# EAGLE schematic 20180513_Frontboard (EAGLE 9.0.1)
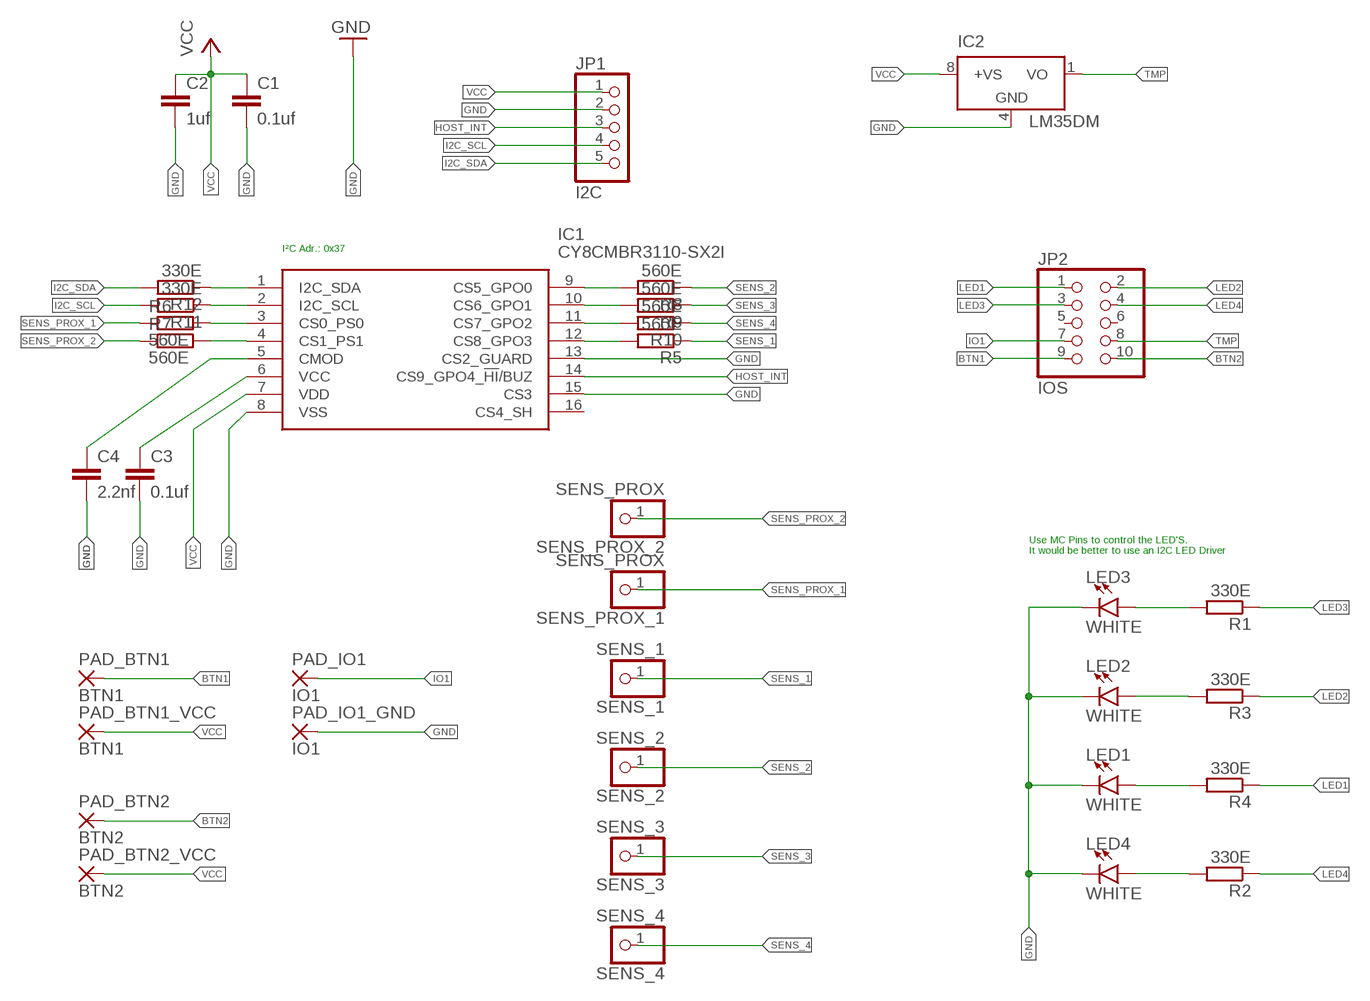
[diagram p0: schematic, sheet 1]

## Parts
C1  0.1uf  C-EUC0805  [C0805]
C2  1uf  C-EUC0805  [C0805]
C3  0.1uf  C-EUC0805  [C0805]
C4  2.2nf  C-EUC0805  [C0805]
IC1  CY8CMBR3110-SX2I  [SOIC127P600X173-16N]
IC2  LM35DM  [SO08]
JP1  I2C  PINHD-1X5_2.54-SMD  [1X05SMD]
JP2  IOS  PINHD-2X5_2.54-SMD  [2X05SMD]
LED1  WHITE  LED1206-BOTTOM  [LED-1206-BOTTOM]
LED2  WHITE  LED1206-BOTTOM  [LED-1206-BOTTOM]
LED3  WHITE  LED1206-BOTTOM  [LED-1206-BOTTOM]
LED4  WHITE  LED1206-BOTTOM  [LED-1206-BOTTOM]
PAD_BTN1  BTN1  2,54/1,0  [2,54/1,0]
PAD_BTN1_VCC  BTN1  2,54/1,0  [2,54/1,0]
PAD_BTN2  BTN2  2,54/1,0  [2,54/1,0]
PAD_BTN2_VCC  BTN2  2,54/1,0  [2,54/1,0]
PAD_IO1  IO1  2,54/1,0  [2,54/1,0]
PAD_IO1_GND  IO1  2,54/1,0  [2,54/1,0]
R1  330E  R-EU_R0805  [R0805]
R2  330E  R-EU_R0805  [R0805]
R3  330E  R-EU_R0805  [R0805]
R4  330E  R-EU_R0805  [R0805]
R5  560E  R-EU_R0805  [R0805]
R6  560E  R-EU_R0805  [R0805]
R7  560E  R-EU_R0805  [R0805]
R8  560E  R-EU_R0805  [R0805]
R9  560E  R-EU_R0805  [R0805]
R10  560E  R-EU_R0805  [R0805]
R11  330E  R-EU_R0805  [R0805]
R12  330E  R-EU_R0805  [R0805]
SENS_1  SENS_1  WPAD-1-0603  [WPAD-1-0603]
SENS_2  SENS_2  WPAD-1-0603  [WPAD-1-0603]
SENS_3  SENS_3  WPAD-1-0603  [WPAD-1-0603]
SENS_4  SENS_4  WPAD-1-0603  [WPAD-1-0603]
SENS_PROX_1  SENS_PROX  WPAD-1-0603  [WPAD-1-0603]
SENS_PROX_2  SENS_PROX  WPAD-1-0603  [WPAD-1-0603]

## Nets
BTN1: JP2.9 PAD_BTN1.1(P)
BTN2: JP2.10 PAD_BTN2.1(P)
GND: C1.2 C2.2 C3.2 C4.2 IC1.8(VSS) IC1.13(CS2_GUARD) IC1.15(CS3) IC2.4(GND) JP1.2 LED1.C LED2.C LED3.C LED4.C PAD_IO1_GND.1(P)
HOST_INT: IC1.14(CS9_GPO4_!HI!/BUZ) JP1.3
I2C_SCL: JP1.4 R11.2
I2C_SDA: JP1.5 R12.2
IO1: JP2.7 PAD_IO1.1(P)
LED1: JP2.1 R4.1
LED2: JP2.2 R3.1
LED3: JP2.3 R1.1
LED4: JP2.4 R2.1
N$2: IC1.9(CS5_GPO0) R8.2
N$3: IC1.10(CS6_GPO1) R9.2
N$4: IC1.11(CS7_GPO2) R10.2
N$5: IC1.1(I2C_SDA) R12.1
N$6: IC1.2(I2C_SCL) R11.1
N$7: IC1.3(CS0_PS0) R6.2
N$8: IC1.12(CS8_GPO3) R5.2
N$9: C3.1 IC1.6(VCC)
N$10: C4.1 IC1.5(CMOD)
N$11: IC1.4(CS1_PS1) R7.2
N$14: LED4.A R2.2
N$15: LED1.A R4.2
N$16: LED2.A R3.2
N$17: LED3.A R1.2
SENS_1: R5.1 SENS_1.1
SENS_2: R8.1 SENS_2.1
SENS_3: R9.1 SENS_3.1
SENS_4: R10.1 SENS_4.1
SENS_PROX_1: R6.1 SENS_PROX_1.1
SENS_PROX_2: R7.1 SENS_PROX_2.1
TMP: IC2.1(VO) JP2.8
VCC: C1.1 C2.1 IC1.7(VDD) IC2.8(+VS) JP1.1 PAD_BTN1_VCC.1(P) PAD_BTN2_VCC.1(P)
Unconnected: IC1.16(CS4_SH) JP2.5 JP2.6

## Notes on the sheet
- I²C Adr.: 0x37
- Use MC Pins to control the LED'S. 
  It would be better to use an I2C LED Driver

## Library data of the parts
C1-C4 = rcl:C-EU: CAPACITOR, European symbol; SPICEPREFIX: C
IC1 = CY8CMBR3110-SX2I:CY8CMBR3110-SX2I: CY8CMBR3xxx Source: Datasheet <http://www.cypress.com/file/46236/download>; ARROW_PART_NUMBER: CY8CMBR3110-SX2I; ARROW_PRICE/STOCK: https://www.arrow.com/en/products/cy8cmbr3110-sx2i/cypress-semiconductor; DESCRIPTION: CY8CMBR3xxx; HEIGHT: mm; MANUFACTURER_NAME: Cypress Semiconductor; MANUFACTURER_PART_NUMBER: CY8CMBR3110-SX2I; RS_PART_NUMBER: 1242975P; RS_PRICE/STOCK: http://uk.rs-online.com/web/p/products/1242975P
IC2 = lm35 (2):LM35: Single-Supply Centigrade Temperature Sensor Vout = (10mV/°C x Temp °C) +5mmmV Source: http://www.national.com/ds/LM/LM35.pdf
JP1 = pinhead:PINHD-1X5: PIN HEADER
JP2 = pinhead:PINHD-2X5: PIN HEADER
LED1-LED4 = SparkFun-LED:LED: LED (Generic) Standard schematic elements and footprints for 5mm, 3mm, 1206, and 0603 sized LEDs. Generic LEDs with no color specified.
PAD_BTN1 PAD_BTN1_VCC PAD_BTN2 PAD_BTN2_VCC PAD_IO1 PAD_IO1_GND = wirepad:2,54/1,0: THROUGH-HOLE PAD
R1-R12 = resistor:R-EU_: RESISTOR, European symbol
SENS_1-SENS_4 SENS_PROX_1 SENS_PROX_2 = PatternAgents-ProtoPads:WPAD-1: Wire Pad - Single Good for scope lead clips, test jumpers, probe points, etc. PatternAgents ProtoPads Library Schematic and PCB layout libraries for design patterns by PatternAgents. For the CADSoft Eagle CAD program : http://www.cadsoftusa.com/download-eagle/ Source LBR : http://www.patternagents.com Github : https://github.com/PatternAgents License : http://creativecommons.org/licenses/by-sa/4.0/ (Creative Commons 4.0) THIS SOFTWARE IS PROVIDED BY THE CONTRIBUTORS "AS IS" AND WITHOUT ANY EXPRESS OR IMPLIED WARRANTIES, INCLUDING, BUT NOT LIMITED TO, THE IMPLIED WARRANTIES OF MERCHANTABILITY AND FITNESS FOR A PARTICULAR PURPOSE ARE DISCLAIMED. IN NO EVENT SHALL THE COPYRIGHT OWNER OR CONTRIBUTORS BE LIABLE FOR ANY DIRECT, INDIRECT, INCIDENTAL, SPECIAL, EXEMPLARY, OR CONSEQUENTIAL DAMAGES (INCLUDING, BUT NOT LIMITED TO, PROCUREMENT OF SUBSTITUTE GOODS OR SERVICES; LOSS OF USE, DATA, OR PROFITS; OR BUSINESS INTERRUPTION) HOWEVER CAUSED AND ON ANY THEORY OF LIABILITY, WHETHER IN CONTRACT, STRICT LIABILITY, OR TORT (INCLUDING NEGLIGENCE OR OTHERWISE) ARISING IN ANY WAY OUT OF THE USE OF THIS SOFTWARE, EVEN IF ADVISED OF THE POSSIBILITY OF SUCH DAMAGE.; BOM: EXCLUDE

## Net classes
0 default: width 0.203 mm